# Altium schematic sheet Design.SchDoc: Heart Rate Monitor
size B; DrawnBy: Evan Reeves; Revision: A; SheetNumber: 2; SheetTotal: 2
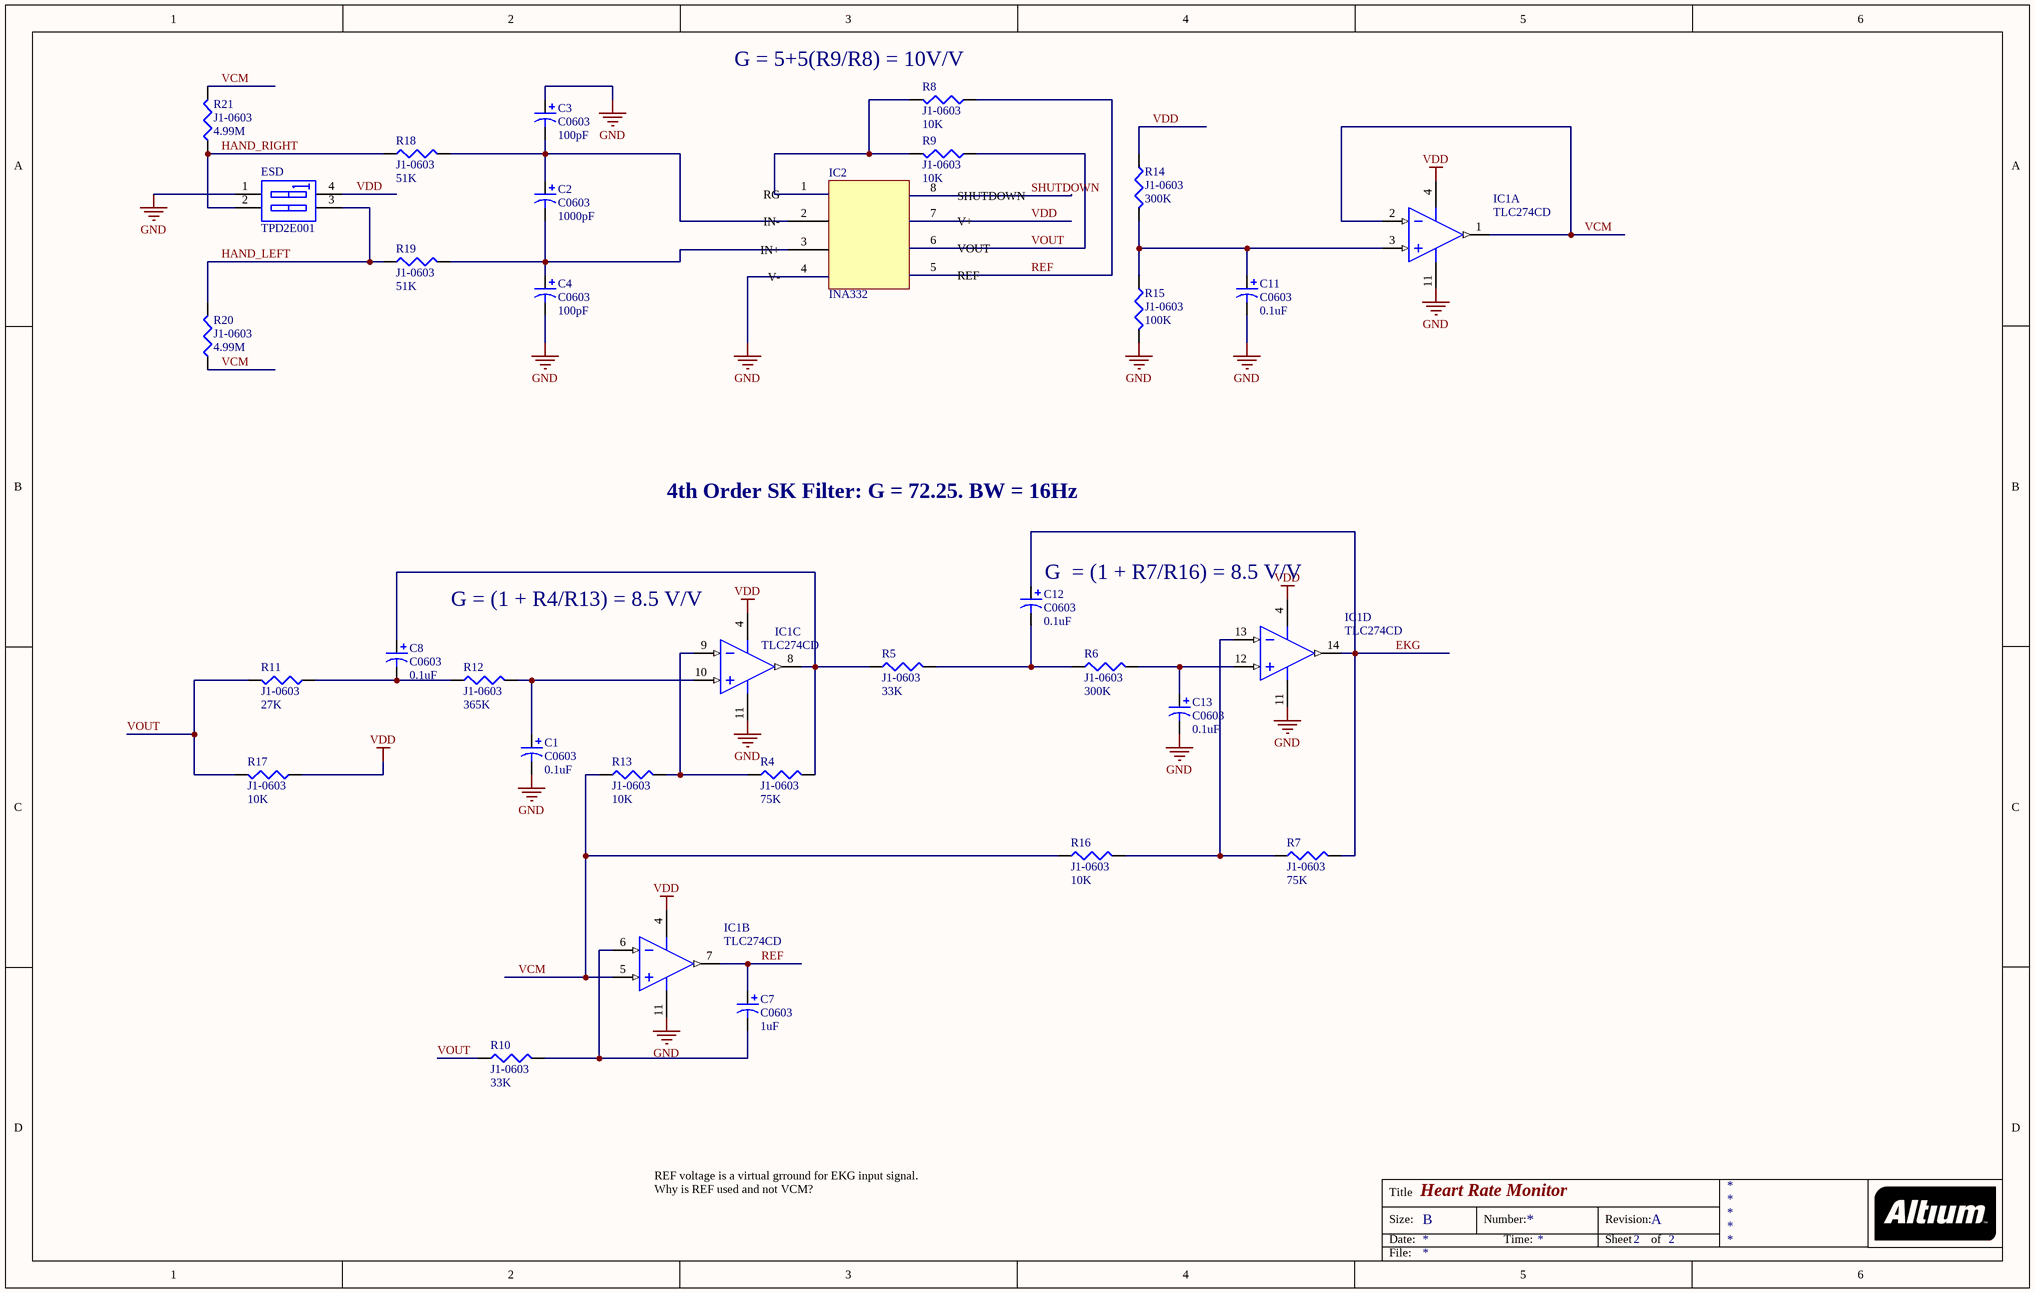
[diagram p0: Design.SchDoc]

## Parts
C1  C0603  value 0.1uF  [RESC0603N]
C2  C0603  value 1000pF  [RESC0603N]
C3  C0603  value 100pF  [RESC0603N]
C4  C0603  value 100pF  [RESC0603N]
C7  C0603  value 1uF  [RESC0603N]
C8  C0603  value 0.1uF  [RESC0603N]
C11  C0603  value 0.1uF  [RESC0603N]
C12  C0603  value 0.1uF  [RESC0603N]
C13  C0603  value 0.1uF  [RESC0603N]
ESD  TPD2E001  [SOT143N]
IC1  TLC274CD  [D014_N]  (parts A,B,C,D of 4)
IC2  INA332  [TSOP65P490-8AN]
R4  J1-0603  value 75K  [RESC0603N]
R5  J1-0603  value 33K  [RESC0603N]
R6  J1-0603  value 300K  [RESC0603N]
R7  J1-0603  value 75K  [RESC0603N]
R8  J1-0603  value 10K  [RESC0603N]
R9  J1-0603  value 10K  [RESC0603N]
R10  J1-0603  value 33K  [RESC0603N]
R11  J1-0603  value 27K  [RESC0603N]
R12  J1-0603  value 365K  [RESC0603N]
R13  J1-0603  value 10K  [RESC0603N]
R14  J1-0603  value 300K  [RESC0603N]
R15  J1-0603  value 100K  [RESC0603N]
R16  J1-0603  value 10K  [RESC0603N]
R17  J1-0603  value 10K  [RESC0603N]
R18  J1-0603  value 51K  [RESC0603N]
R19  J1-0603  value 51K  [RESC0603N]
R20  J1-0603  value 4.99M  [RESC0603N]
R21  J1-0603  value 4.99M  [RESC0603N]

## Nets
GND: C1.2 C3.1 C4.2 C11.2 C13.2 ESD.1(A1) IC1.11(V-) IC2.4(V-) R15.2
VDD: ESD.4(B1) IC1.4(V+) IC2.7(V+) R14.1 R17.1
EKG: C12.1 IC1.14(OUT) R7.2
HAND_LEFT: ESD.3(B2) R19.1 R20.2
HAND_RIGHT: ESD.2(A2) R18.1 R21.1
REF: C7.1 IC1.7(OUT) IC2.5(REF) R8.1
SHUTDOWN: IC2.8(SHUTDOWN)
VCM: IC1.1(OUT) IC1.2(IN-) IC1.5(IN+) R13.1 R16.1 R20.1 R21.2
VOUT: IC2.6(VOUT) R9.1 R10.1 R11.2 R17.2
NetC1_1: C1.1 IC1.10(IN+) R12.2
NetC2_1: C2.1 C3.2 IC2.2(IN-) R18.2
NetC2_2: C2.2 C4.1 IC2.3(IN+) R19.2
NetC7_2: C7.2 IC1.6(IN-) R10.2
NetC8_1: C8.1 IC1.8(OUT) R4.2 R5.1
NetC8_2: C8.2 R11.1 R12.1
NetC11_1: C11.1 IC1.3(IN+) R14.2 R15.1
NetC12_2: C12.2 R5.2 R6.1
NetC13_1: C13.1 IC1.12(IN+) R6.2
NetIC1_9: IC1.9(IN-) R4.1 R13.2
NetIC1_13: IC1.13(IN-) R7.1 R16.2
NetIC2_1: IC2.1(RG) R8.2 R9.2

## Notes on the sheet
- (near R8) G = 5+5(R9/R8) = 10V/V
- 4th Order SK Filter: G = 72.25. BW = 16Hz
- (near IC1) G = (1 + R4/R13) = 8.5 V/V
- (near C12) G  = (1 + R7/R16) = 8.5 V/V
- REF voltage is a virtual grround for EKG input signal. Why is REF used and not VCM?
- Title
- Size:
- Date:
- B
- Number:
- Time:
- Revision:
- Sheet
- of
- File:

## Library data of the parts
C1-C4 C7 C8 C11-C13 = Cap Pol3: Polarized Capacitor (Surface Mount); Published: 8-Jun-2000; LatestRevisionDate: 29-May-2009; LatestRevisionNote: IPC-7351 Footprint Added.; PackageReference: C0603; Publisher: Altium Limited; PackageDescription: Chip Capacitor
ESD = SW DIP-2: DIP Switch, 2 Position, SPST; Published: 24-Mar-1999; LatestRevisionDate: 17-Jul-2002; LatestRevisionNote: Re-released for DXP Platform.; PackageReference: DIP-4; Publisher: Altium Limited
IC1 = TLC274CD: LinCMOS Precision Quad Operational Amplifier; Published: 15-Apr-2002; LatestRevisionDate: 13-Apr-2006; LatestRevisionNote: IPC-7351 Footprint Added.; DatasheetVersion: Aug-1988; PackageVersion: Jan-1998; PackageReference: D014; Publisher: Altium Limited; PackageDescription: 14-Pin Small Outline Integrated Circuit 1.27 mm Pitch; Code_IPC: SOIC127P600-14; ComponentLink1Description: Manufacturer Link; ComponentLink1URL: http://www.ti.com/; ComponentLink2Description: Datasheet; ComponentLink2URL: http://www-s.ti.com/sc/ds/tlc274a.pdf
IC2 = INA332: Instrumentation Amp MSOP-8; PN: INA332AIDGK
R4-R21 = Res3: Resistor; Published: 8-Jun-2000; LatestRevisionDate: 29-May-2009; LatestRevisionNote: IPC-7351 Footprint Added.; PackageReference: J1-0603; Publisher: Altium Limited; PackageDescription: Chip Resistor